# Altium schematic sheet AC_CONTROL.SchDoc
size A3; SheetNumber: 12; SheetTotal: 15
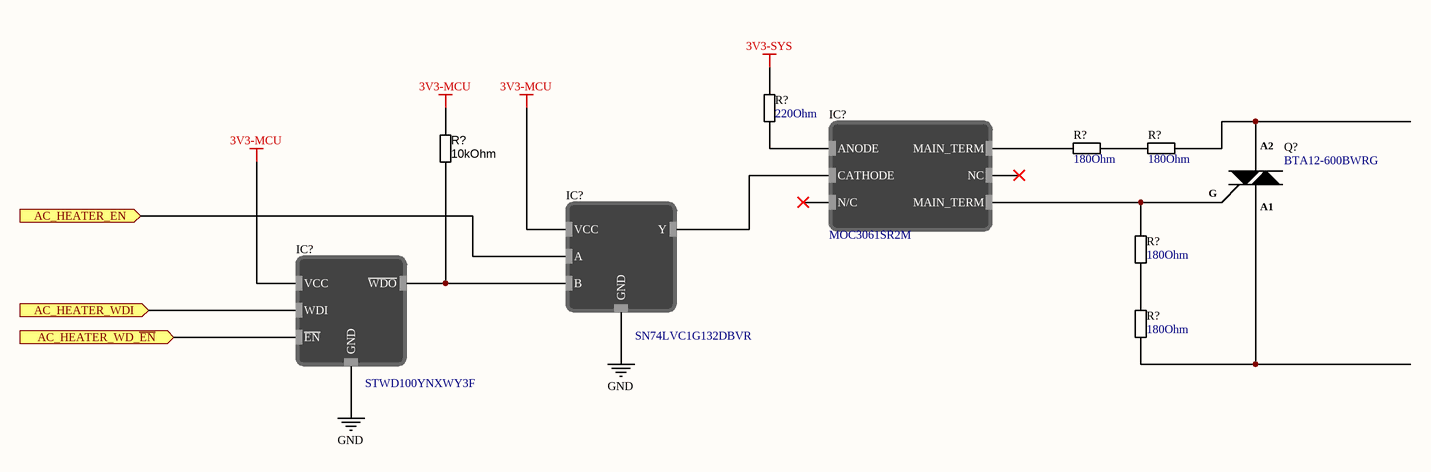
[diagram p0: AC_CONTROL.SchDoc]

## Parts
(Parts that share a designator on the sheet are numbered #1, #2 ... from top to bottom, then left to right.)
IC?#1  MOC3061SR2M  [SOT254P916X508-6N]
IC?#2  SN74LVC1G132DBVR  [SC70-5]
IC?#3  STWD100YNXWY3F  [SOT23_5]
Q?  BTA12-600BWRG  [TO-220AB_STM]
R?#1  220Ohm  [RES_0603]
R?#2  10kOhm  [RES_0603]
R?#3  180Ohm  [RES_1206]
R?#4  180Ohm  [RES_1206]
R?#5  180Ohm  [RES_1206]
R?#6  180Ohm  [RES_1206]

## Ports
AC_HEATER_EN (in), AC_HEATER_WD_~{EN} (in), AC_HEATER_WDI (in)

## Nets
3V3-MCU: IC?#2.5(VCC) IC?#3.5(VCC) R?#2.2
3V3-SYS: R?#1.2
GND: IC?#2.3(GND) IC?#3.2(GND)
AC_HEATER_EN: IC?#2.1(A) ; port AC_HEATER_EN
AC_HEATER_WD_~{EN}: IC?#3.3(~{EN}) ; port AC_HEATER_WD_~{EN}
AC_HEATER_WDI: IC?#3.4(WDI) ; port AC_HEATER_WDI
NetIC?#1_1: IC?#1.1(ANODE) R?#1.1
NetIC?#1_2: IC?#1.2(CATHODE) IC?#2.4(Y)
NetIC?#1_4: IC?#1.4(MAIN_TERM) Q?.3(G) R?#5.2
NetIC?#1_6: IC?#1.6(MAIN_TERM) R?#3.1
NetIC?#2_2: IC?#2.2(B) IC?#3.1(~{WDO}) R?#2.1
NetQ?_1: Q?.1(A1) R?#6.1
NetQ?_2: Q?.2(A2) R?#4.2
NetR?#3_2: R?#3.2 R?#4.1
NetR?#5_1: R?#5.1 R?#6.2

Not connected (* = marked no-connect by the designer): IC?#1 3(N/C)* 5(NC)*

## Library data of the parts
IC?#1 = MOC3061SR2M: Optoisolator Triac Output 4170Vrms 1 Channel 6-SMD; DigiKey Part Number: MOC3061SR2MCT-ND; ComponentLink1Description: DigiKey; ComponentLink1URL: https://www.digikey.com/en/products/detail/onsemi/MOC3061SR2M/401969?s=N4IgTCBcDaILIHkDCBmADANgIwGUBKYcIAugL5A; Mouser Part Number: 512-MOC3061SR2M; ComponentLink2Description: Mouser; ComponentLink2URL: https://eu.mouser.com/ProductDetail/onsemi/MOC3061SR2M?qs=QsyUFYHC2%2FbVF%2F%252BX5tJ1cA%3D%3D; Manufacturer Product Number: MOC3061SR2M; JLCPCB Part Number: C41647
IC?#2 = SN74LVC1G132DBVR: NAND Gate IC 1 Channel Schmitt Trigger SOT-23-5; DigiKey Part Number: 296-17888-1-ND; ComponentLink1Description: DigiKey; ComponentLink1URL: https://www.digikey.com/en/products/detail/texas-instruments/SN74LVC1G132DBVR/758692; Mouser Part Number: 595-SN74LVC1G132DBVR; ComponentLink2Description: Mouser; ComponentLink2URL: https://eu.mouser.com/ProductDetail/Texas-Instruments/SN74LVC1G132DBVR?qs=nqigI8dpoHLJT%252BKWcXCBlg%3D%3D; Manufacturer Product Number: SN74LVC1G132DBVR; JLCPCB Part Number: C403723
IC?#3 = STWD100YNXWY3F: Supervisor Open Drain or Open Collector 1 Channel SOT-23-5; DigiKey Part Number: 497-19691-ND; ComponentLink1Description: DigiKey; ComponentLink1URL: https://www.digikey.com/en/products/detail/stmicroelectronics/STWD100YNXWY3F/9557110?s=N4IgTCBcDaIMoBUDqARAjABgwTQHIA0QBdAXyA; Mouser Part Number: 511-STWD100YNXWY3F; ComponentLink2Description: Mouser; ComponentLink2URL: https://eu.mouser.com/ProductDetail/STMicroelectronics/STWD100YNXWY3F?qs=lYGu3FyN48fznrqImiJDzw%3D%3D; Manufacturer Product Number: STWD100YNXWY3F; JLCPCB Part Number: C1354132
Q? = 00000017: TRIAC Alternistor - Snubberless 600 V 12 A Through Hole TO-220; DigiKey Part Number: 497-3121-5-ND; Mouser Part Number: 511-BTA12-600BW; ComponentLink1Description: DigiKey; ComponentLink1URL: https://www.digikey.com/en/products/detail/stmicroelectronics/BTA12-600BWRG/654429; ComponentLink2Description: Mouser; ComponentLink2URL: https://eu.mouser.com/ProductDetail/STMicroelectronics/BTA12-600BWRG?qs=%2Fa2FmOVcLL8l0HzVHcBh3g%3D%3D; Manufacturer Product Number: BTA12-600BWRG; JLCPCB Part Number: C427100
R?#1 = R000021: 220 Ohms ±5% 0.1W, 1/10W Chip Resistor 0603 (1608 Metric) Automotive AEC-Q200 Thick Film; Manufacturer Product Number: ERJ-3GEYJ221V; ComponentLink1Description: DigiKey; ComponentLink1URL: https://www.digikey.com/en/products/detail/panasonic-electronic-components/ERJ-3GEYJ221V/135719; resistance: 220Ohm; DigiKey Part Number: P220GCT-ND
R?#2 = R000001: 10 kOhms ±1% 0.125W, 1/8W Chip Resistor 0603 (1608 Metric) Anti-Sulfur Thin Film; Manufacturer Product Number: MCT06030C1002FP500; resistance: 10kOhm; ComponentLink1Description: DigiKey; ComponentLink1URL: https://www.digikey.com/en/products/detail/vishay-beyschlag-draloric-bc-components/MCT06030C1002FP500/1850440; DigiKey Part Number: MCT0603-10.0K-CFCT-ND
R?#3-R?#6 = R000037: 180 Ohms ±5% 0.25W, 1/4W Chip Resistor 1206 (3216 Metric) Moisture Resistant Thick Film; Manufacturer Product Number: RC1206JR-07180RL; ComponentLink1Description: DigiKey; ComponentLink1URL: https://www.digikey.com/en/products/detail/yageo/RC1206JR-07180RL/729231; resistance: 180Ohm; DigiKey Part Number: 311-180ERCT-ND; JLCPCB Part Number: C137193